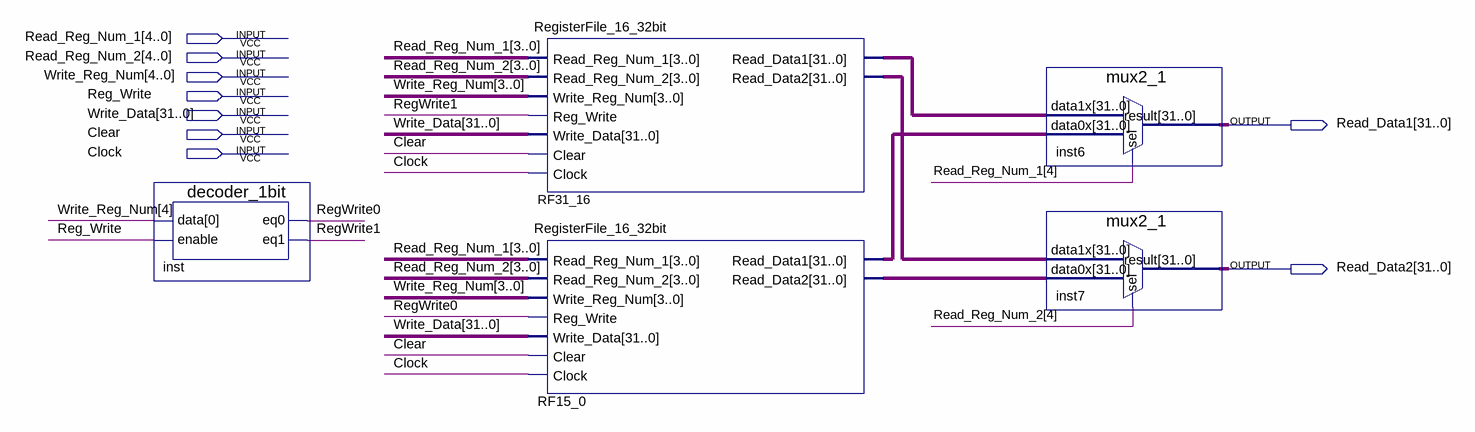
[diagram p0: schematic sheet]
// Quartus schematic RegisterFile_32.bdf as structural Verilog: 5 symbols, 9 pins
module RegisterFile_32 (
  input  [4:0] Read_Reg_Num_1,
  input  [4:0] Read_Reg_Num_2,
  input  [4:0] Write_Reg_Num,
  input  Reg_Write,
  input  [31:0] Write_Data,
  input  Clear,
  input  Clock,
  output [31:0] Read_Data1,
  output [31:0] Read_Data2
);

  wire RegWrite0, RegWrite1;
  wire [31:0] RF15_0_read_data1, RF15_0_read_data2, RF31_16_read_data1, RF31_16_read_data2;

  decoder_1bit inst (.data(Write_Reg_Num[4]), .enable(Reg_Write), .eq0(RegWrite0), .eq1(RegWrite1));
  RegisterFile_16_32bit RF31_16 (
    .Read_Reg_Num_1(Read_Reg_Num_1[3:0]), .Read_Reg_Num_2(Read_Reg_Num_2[3:0]),
    .Write_Reg_Num(Write_Reg_Num[3:0]), .Reg_Write(RegWrite1), .Write_Data(Write_Data), .Clear(Clear),
    .Clock(Clock), .Read_Data1(RF31_16_read_data1), .Read_Data2(RF31_16_read_data2));
  RegisterFile_16_32bit RF15_0 (
    .Read_Reg_Num_1(Read_Reg_Num_1[3:0]), .Read_Reg_Num_2(Read_Reg_Num_2[3:0]),
    .Write_Reg_Num(Write_Reg_Num[3:0]), .Reg_Write(RegWrite0), .Write_Data(Write_Data), .Clear(Clear),
    .Clock(Clock), .Read_Data1(RF15_0_read_data1), .Read_Data2(RF15_0_read_data2));
  mux2_1 inst6 (.data1x(RF31_16_read_data1), .data0x(RF15_0_read_data1), .sel(Read_Reg_Num_1[4]), .result(Read_Data1));
  mux2_1 inst7 (.data1x(RF31_16_read_data2), .data0x(RF15_0_read_data2), .sel(Read_Reg_Num_2[4]), .result(Read_Data2));
endmodule
